# Altium schematic sheet LPCB235 - RM48 - 100BASET.SchDoc
size A3; Address1: Unit 4; DocumentNumber: 24; Revision: 2; SheetNumber: 24; SheetTotal: 37; Lockie__PCB_SUB_ASSEMBLY: EMAC; Lockie__PCB_ASSEMBLY: FCU PCB; Lockie__LDL: LPCB235; Lockie__PCB_DESCRIPTION: Flight Control Unit
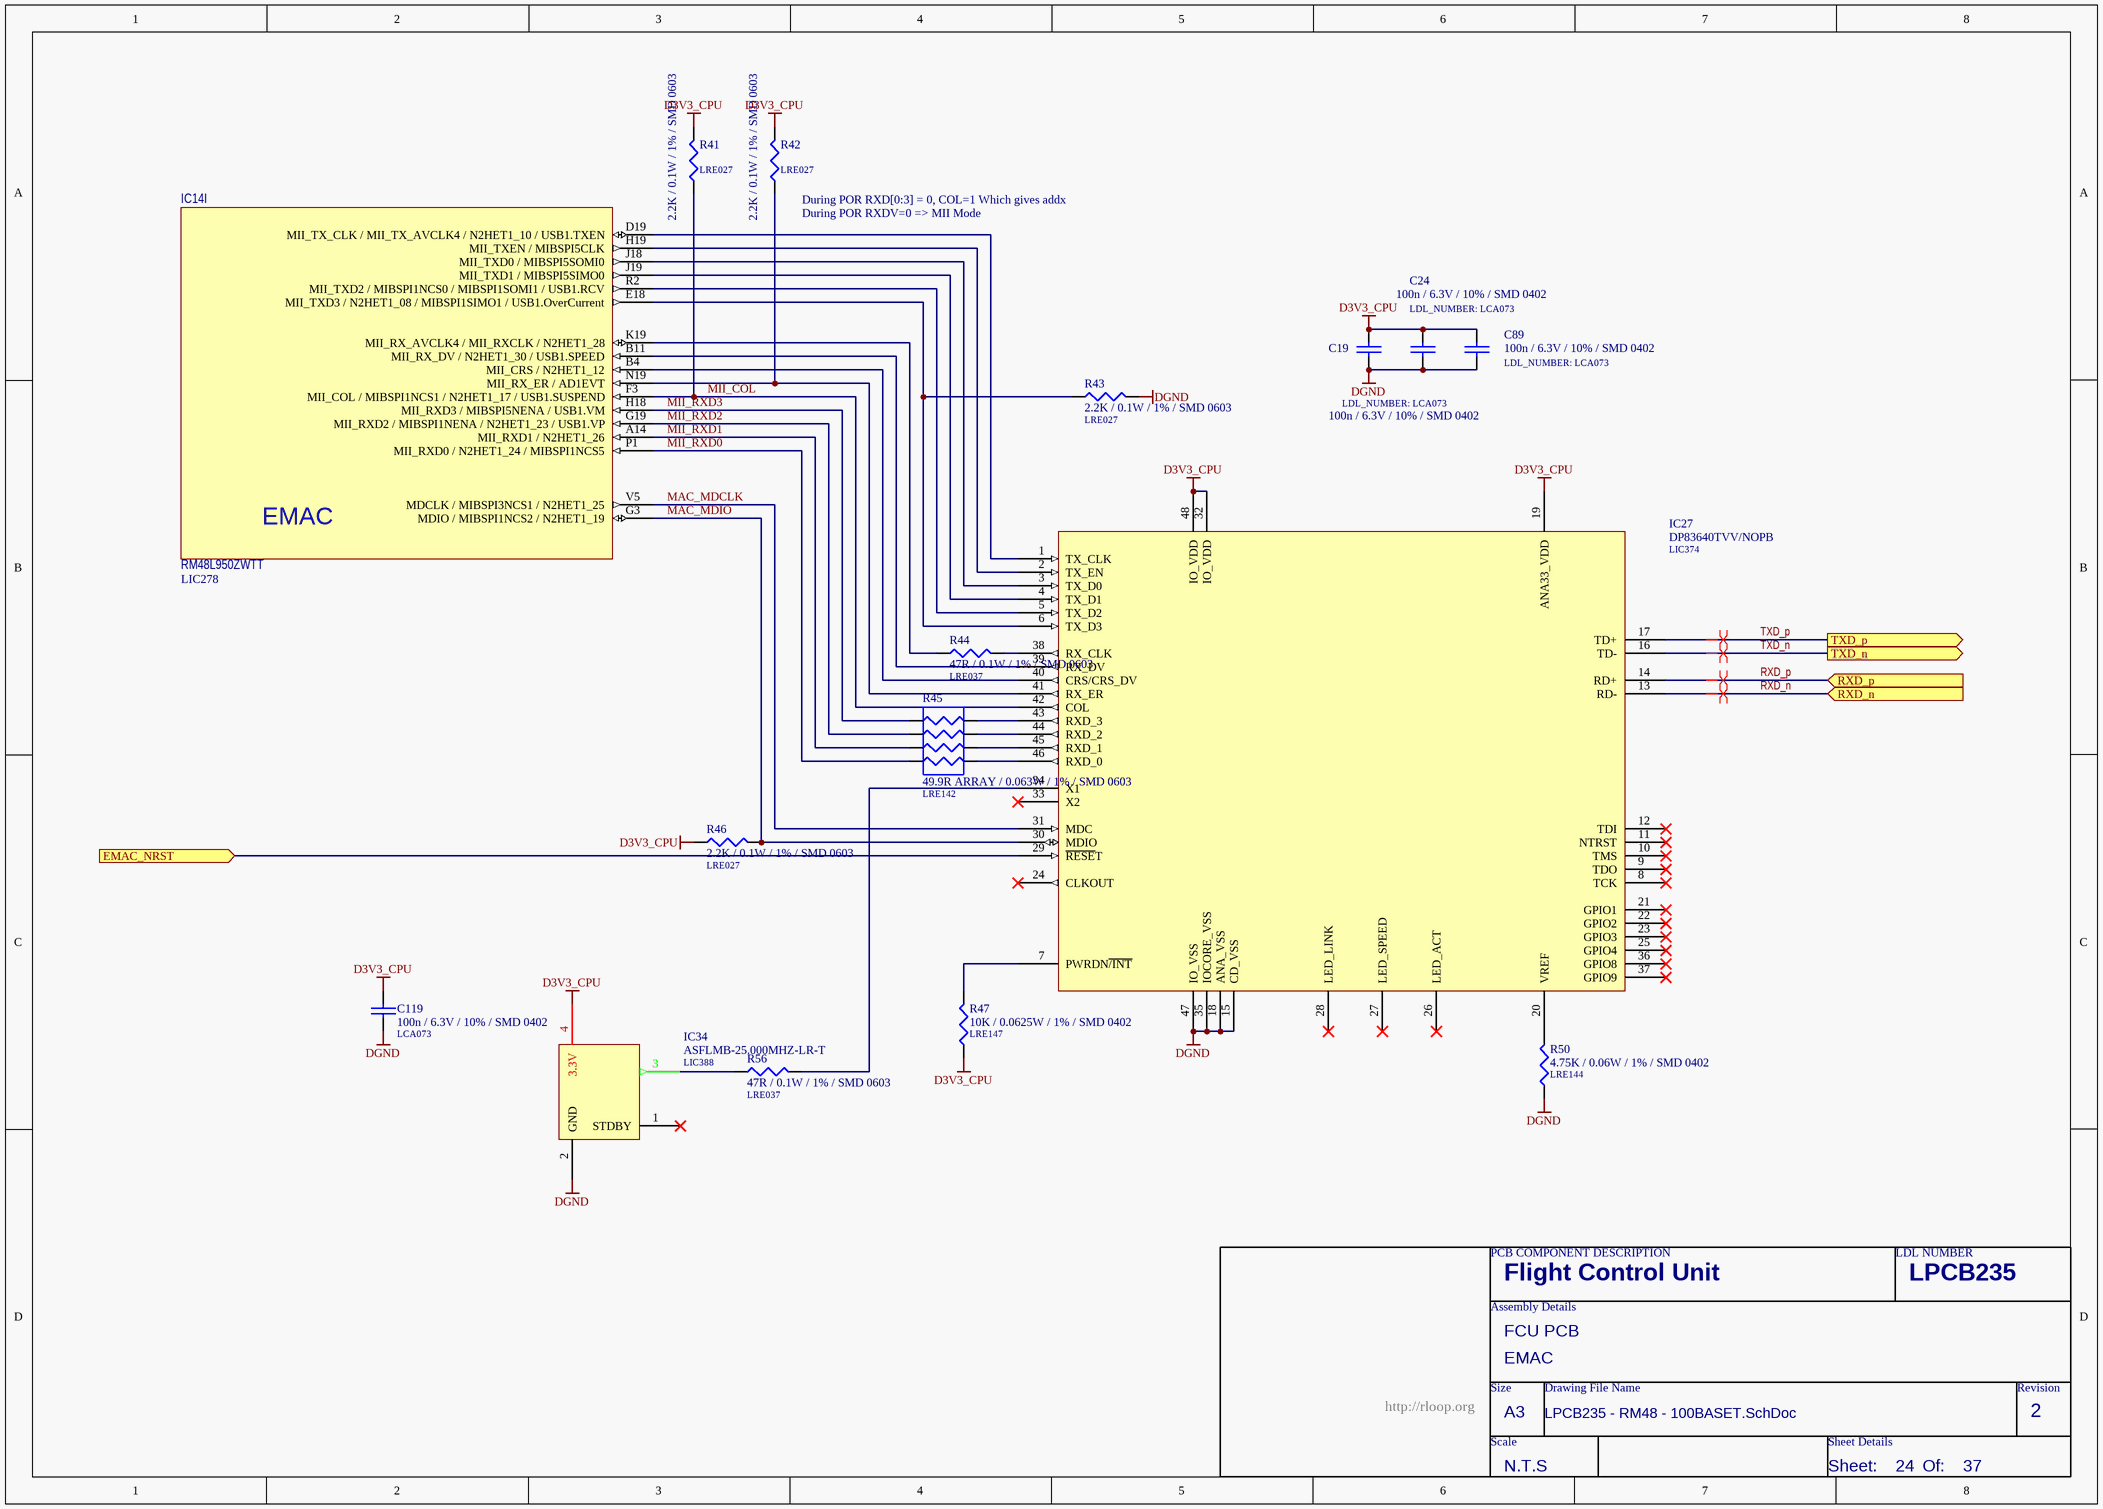
[diagram p0: LPCB235 - RM48 - 100BASET.SchDoc]

## Parts
C19  100n / 6.3V / 10% / SMD 0402  LDL_NUMBER: LCA073  [LFP012__CC1005-0402-IPC7351_B]
C24  100n / 6.3V / 10% / SMD 0402  LDL_NUMBER: LCA073  [LFP012__CC1005-0402-IPC7351_B]
C89  100n / 6.3V / 10% / SMD 0402  LDL_NUMBER: LCA073  [LFP012__CC1005-0402-IPC7351_B]
C119  100n / 6.3V / 10% / SMD 0402  LDL_NUMBER: LCA073  [LFP012__CC1005-0402-IPC7351_B]
IC14  RM48L950ZWTT  LDL_NUMBER: LIC278  [LFP054__ZWT (S-PBGA-N337)]  (part I of 10)
IC27  DP83640TVV/NOPB  LDL_NUMBER: LIC374  [LFP058__F-QFP7X7-G48]
IC34  ASFLMB-25.000MHZ-LR-T  LDL_NUMBER: LIC388  [LFP072__ASFLMB]
R41  2.2K / 0.1W / 1% / SMD 0603  LDL_NUMBER: LRE027  [LFP020__CR1608-0603-IPC7351_B]
R42  2.2K / 0.1W / 1% / SMD 0603  LDL_NUMBER: LRE027  [LFP020__CR1608-0603-IPC7351_B]
R43  2.2K / 0.1W / 1% / SMD 0603  LDL_NUMBER: LRE027  [LFP020__CR1608-0603-IPC7351_B]
R44  47R / 0.1W / 1% / SMD 0603  LDL_NUMBER: LRE037  [LFP020__CR1608-0603-IPC7351_B]
R45  49.9R ARRAY / 0.063W / 1% / SMD 0603  LDL_NUMBER: LRE142  [LFP065__RESPACK4-0603]
R46  2.2K / 0.1W / 1% / SMD 0603  LDL_NUMBER: LRE027  [LFP020__CR1608-0603-IPC7351_B]
R47  10K / 0.0625W / 1% / SMD 0402  LDL_NUMBER: LRE147  [LFP030__CR1005-0402-IPC7351]
R50  4.75K / 0.06W / 1% / SMD 0402  LDL_NUMBER: LRE144  [LFP030__CR1005-0402-IPC7351]
R56  47R / 0.1W / 1% / SMD 0603  LDL_NUMBER: LRE037  [LFP020__CR1608-0603-IPC7351_B]

## Ports
EMAC_NRST (in), RXD_n (in), RXD_p (in), TXD_n (out), TXD_p (out)

## Nets
D3V3_CPU: C19.1 C24.1 C89.1 C119.1 IC27.19(ANA33_VDD) IC27.32(IO_VDD) IC27.48(IO_VDD) IC34.4(3.3V) R41.2 R42.2 R46.1 R47.1
DGND: C19.2 C24.2 C89.2 C119.2 IC27.15(CD_VSS) IC27.18(ANA_VSS) IC27.35(IOCORE_VSS) IC27.47(IO_VSS) IC34.2(GND) R43.2 R50.1
EMAC_NRST: IC27.29(~{RESE}T) ; port EMAC_NRST
MAC_MDCLK: IC14.V5(MDCLK_/_MIBSPI3NCS1_/_N2HET1_25) IC27.31(MDC)
MAC_MDIO: IC14.G3(MDIO_/_MIBSPI1NCS2_/_N2HET1_19) IC27.30(MDIO) R46.2
MII_COL: IC14.F3(MII_COL_/_MIBSPI1NCS1_/_N2HET1_17_/_USB1.SUSPEND) IC27.42(COL) R41.1
MII_RXD0: IC14.P1(MII_RXD0_/_N2HET1_24_/_MIBSPI1NCS5) R45.4
MII_RXD1: IC14.A14(MII_RXD1_/_N2HET1_26) R45.3
MII_RXD2: IC14.G19(MII_RXD2_/_MIBSPI1NENA_/_N2HET1_23_/_USB1.VP) R45.2
MII_RXD3: IC14.H18(MII_RXD3_/_MIBSPI5NENA_/_USB1.VM) R45.1
RXD_n: IC27.13(RD-) ; port RXD_n
RXD_p: IC27.14(RD+) ; port RXD_p
TXD_n: IC27.16(TD-) ; port TXD_n
TXD_p: IC27.17(TD+) ; port TXD_p
NetIC14_B4: IC14.B4(MII_CRS_/_N2HET1_12) IC27.40(CRS/CRS_DV)
NetIC14_B11: IC14.B11(MII_RX_DV_/_N2HET1_30_/_USB1.SPEED) IC27.39(RX_DV)
NetIC14_D19: IC14.D19(MII_TX_CLK_/_MII_TX_AVCLK4_/_N2HET1_10_/_USB1.TXEN) IC27.1(TX_CLK)
NetIC14_E18: IC14.E18(MII_TXD3_/_N2HET1_08_/_MIBSPI1SIMO1_/_USB1.OverCurrent) IC27.6(TX_D3) R43.1
NetIC14_H19: IC14.H19(MII_TXEN_/_MIBSPI5CLK) IC27.2(TX_EN)
NetIC14_J18: IC14.J18(MII_TXD0_/_MIBSPI5SOMI0) IC27.3(TX_D0)
NetIC14_J19: IC14.J19(MII_TXD1_/_MIBSPI5SIMO0) IC27.4(TX_D1)
NetIC14_K19: IC14.K19(MII_RX_AVCLK4_/_MII_RXCLK_/_N2HET1_28) R44.1
NetIC14_N19: IC14.N19(MII_RX_ER_/_AD1EVT) IC27.41(RX_ER) R42.1
NetIC14_R2: IC14.R2(MII_TXD2_/_MIBSPI1NCS0_/_MIBSPI1SOMI1_/_USB1.RCV) IC27.5(TX_D2)
NetIC27_7: IC27.7(PWRDN~{/INT}) R47.2
NetIC27_20: IC27.20(VREF) R50.2
NetIC27_34: IC27.34(X1) R56.2
NetIC27_38: IC27.38(RX_CLK) R44.2
NetIC27_43: IC27.43(RXD_3) R45.8
NetIC27_44: IC27.44(RXD_2) R45.7
NetIC27_45: IC27.45(RXD_1) R45.6
NetIC27_46: IC27.46(RXD_0) R45.5
NetIC34_3: IC34.3(OUT) R56.1

Not connected (* = marked no-connect by the designer): IC27 8(TCK)* 9(TDO)* 10(TMS)* 11(NTRST)* 12(TDI)* 21(GPIO1)* 22(GPIO2)* 23(GPIO3)* 24(CLKOUT)* 25(GPIO4)* 26(LED_ACT)* 27(LED_SPEED)* 28(LED_LINK)* 33(X2)* 36(GPIO8)* 37(GPIO9)*; IC34 1(STDBY)*

## Layout directives
differential pair: RXD_n, RXD_p, TXD_n, TXD_p

## Notes on the sheet
- (near R42) During POR RXD[0:3] = 0, COL=1 Which gives addx
- (near R42) During POR RXDV=0 => MII Mode
- PCB COMPONENT DESCRIPTION
- LDL NUMBER
- Assembly Details
- Size
- Drawing File Name
- Revision
- http://rloop.org
- Scale
- A3
- Sheet Details
- N.T.S
- Sheet:
- Of:
- (in symbol RM48L950ZWTT, part I) EMAC

## Library data of the parts
C19 C24 C89 C119 = 100n / 6.3V / 10% / SMD 0402: Capacitor, Ceramic Chip, 100nF (0.1uF), 6.3V, 10%, SMD 0402 [LCA073]; FMEDA__OPERATING__TEMP_MAX: 50; FMEDA__OPERATING__TEMP_TYP: 27; FMEDA__OPERATING__TEMP_MIN: -20; FMEDA__OPERATING__VOLTAGE_MAX: 3.3; FMEDA__OPERATING__VOLTAGE_MIN: 0; FMEDA__CHANNEL: COM; Value: 100n; FMEDA__FUNCTION_IN_SYSTEM: *; FMEDA__OPERATING__VOLTAGE_TYP: 3.3
IC14 = RM48L950ZWTT: IC, CPU, RM48 Safety CPU, SMD NFBGA337 [LIC278]; FMEDA__FUNCTION_IN_SYSTEM: SAFETY CPU 1; FMEDA__OPERATING__TEMP_MIN: -20; FMEDA__OPERATING__TEMP_TYP: 27; FMEDA__OPERATING__TEMP_MAX: 50; FMEDA__CHANNEL: COM
IC27 = DP83640TVV/NOPB: IC, Ethernet Transceiver, Precision Real Time Protocol, SMD LQFP48 [LIC374]; FMEDA__OPERATING__TEMP_MAX: 50; FMEDA__OPERATING__TEMP_MIN: -20; FMEDA__OPERATING__TEMP_TYP: 27; FMEDA__CHANNEL: COM; FMEDA__OPERATING__VOLTAGE_MAX: 3.3; FMEDA__OPERATING__VOLTAGE_MIN: 0; FMEDA__FUNCTION_IN_SYSTEM: *; FMEDA__OPERATING__VOLTAGE_TYP: 3.3
IC34 = ASFLMB-25.000MHZ-LR-T: IC, Oscillator Module, 25MHz, 3.3V, SMD [LIC388]; FMEDA__OPERATING__TEMP_MAX: 50; FMEDA__OPERATING__TEMP_MIN: -20; FMEDA__OPERATING__TEMP_TYP: 27; FMEDA__OPERATING__VOLTAGE_MAX: 3.3; FMEDA__OPERATING__VOLTAGE_MIN: 0; FMEDA__CHANNEL: COM; FMEDA__OPERATING__VOLTAGE_TYP: 3.3; FMEDA__FUNCTION_IN_SYSTEM: *
R41-R43 = 2.2K / 0.1W / 1% / SMD 0603: Resistor, Ceramic Chip, 2.2K, 0.1W, 1%, SMD 0603 [LRE027]; FMEDA__OPERATING__VOLTAGE_MIN: 0; FMEDA__OPERATING__TEMP_MIN: -20; FMEDA__OPERATING__TEMP_TYP: 27; FMEDA__OPERATING__TEMP_MAX: 50; FMEDA__CHANNEL: COM; VALUE: 2.2K; FMEDA__OPERATING__VOLTAGE_MAX: 0; FMEDA__OPERATING__POWER_MIN: 0; FMEDA__OPERATING__POWER_MAX: 0; FMEDA__FUNCTION_IN_SYSTEM: *; FMEDA__OPERATING__VOLTAGE_TYP: 0
R44 R56 = 47R / 0.1W / 1% / SMD 0603: Resistor, Ceramic Chip, 47R, 0.1W, 1%, SMD 0603 [LRE037]; VALUE: 47; FMEDA__OPERATING__POWER_MAX: 0; FMEDA__OPERATING__TEMP_MAX: 50; FMEDA__OPERATING__TEMP_MIN: -20; FMEDA__OPERATING__TEMP_TYP: 27; FMEDA__CHANNEL: COM; FMEDA__OPERATING__POWER_MIN: 0; FMEDA__OPERATING__VOLTAGE_MAX: 0; FMEDA__OPERATING__VOLTAGE_MIN: 0; FMEDA__OPERATING__VOLTAGE_TYP: 0; FMEDA__FUNCTION_IN_SYSTEM: *
R45 = 49.9R ARRAY / 0.063W / 1% / SMD 0603: Resistor, Array, 49.9R, 0.063W, 1%, SMD 0603 [LRE142]; Value: 49.9; FMEDA__OPERATING__POWER_MAX: 0; FMEDA__OPERATING__TEMP_MAX: 50; FMEDA__OPERATING__TEMP_MIN: -20; FMEDA__OPERATING__TEMP_TYP: 27; FMEDA__CHANNEL: COM; FMEDA__OPERATING__POWER_MIN: 0; FMEDA__OPERATING__VOLTAGE_MAX: 0; FMEDA__OPERATING__VOLTAGE_MIN: 0; FMEDA__OPERATING__VOLTAGE_TYP: 0; FMEDA__FUNCTION_IN_SYSTEM: *
R46 = 2.2K / 0.1W / 1% / SMD 0603: Resistor, Ceramic Chip, 2.2K, 0.1W, 1%, SMD 0603 [LRE027]; FMEDA__OPERATING__POWER_MAX: 0; FMEDA__OPERATING__TEMP_MAX: 50; FMEDA__OPERATING__TEMP_MIN: -20; FMEDA__OPERATING__TEMP_TYP: 27; FMEDA__CHANNEL: COM; VALUE: 2.2K; FMEDA__FUNCTION_IN_SYSTEM: *; FMEDA__OPERATING__POWER_MIN: 0; FMEDA__OPERATING__VOLTAGE_MAX: 0; FMEDA__OPERATING__VOLTAGE_MIN: 0; FMEDA__OPERATING__VOLTAGE_TYP: 0
R47 = 10K / 0.0625W / 1% / SMD 0402: Resistor, Ceramic Chip, 10K, 0.0625W, 1%, SMD 0402 [LRE147]; FMEDA__OPERATING__POWER_MAX: 0; FMEDA__OPERATING__TEMP_MAX: 50; FMEDA__OPERATING__TEMP_MIN: -20; FMEDA__OPERATING__TEMP_TYP: 27; FMEDA__CHANNEL: COM; Value: 10K; FMEDA__OPERATING__POWER_MIN: 0; FMEDA__OPERATING__VOLTAGE_MAX: 0; FMEDA__OPERATING__VOLTAGE_MIN: 0; FMEDA__OPERATING__VOLTAGE_TYP: 0; FMEDA__FUNCTION_IN_SYSTEM: *
R50 = 4.75K / 0.06W / 1% / SMD 0402: Resistor, Ceramic Chip, 4.75K, 0.0625W, 1%, SMD 0402 [LRE144]; Value: 4750; FMEDA__OPERATING__POWER_MAX: 0; FMEDA__OPERATING__TEMP_MAX: 50; FMEDA__OPERATING__TEMP_MIN: -20; FMEDA__OPERATING__TEMP_TYP: 27; FMEDA__CHANNEL: COM; FMEDA__OPERATING__POWER_MIN: 0; FMEDA__OPERATING__VOLTAGE_MAX: 0; FMEDA__OPERATING__VOLTAGE_MIN: 0; FMEDA__OPERATING__VOLTAGE_TYP: 0; FMEDA__FUNCTION_IN_SYSTEM: *